# EAGLE design rail (EAGLE 6.1)
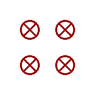
[diagram p0: schematic, sheet 1]

## Parts
JP1  FIDUCIAL1.5X3  [FIDUCIAL-1.5X3]
JP2  FIDUCIAL1.5X3  [FIDUCIAL-1.5X3]
JP3  FIDUCIAL1.5X3  [FIDUCIAL-1.5X3]
JP4  FIDUCIAL1.5X3  [FIDUCIAL-1.5X3]

## Library data of the parts
JP1-JP4 = aspirin:FIDUCIAL: Fiducial Alignment Points Various fiducial points for machine vision alignment.

## Board
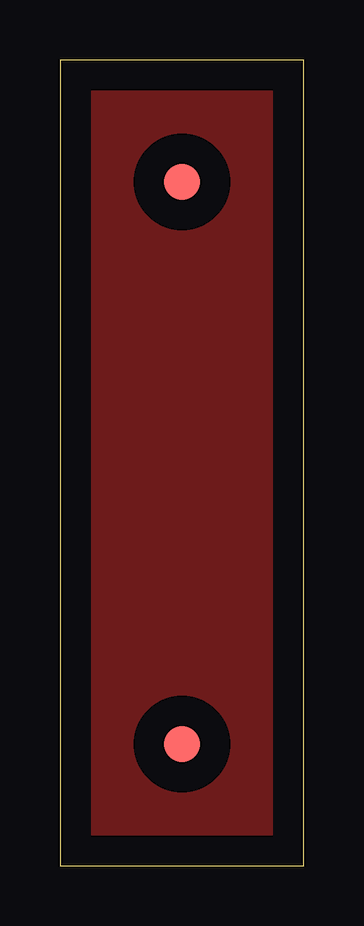
[diagram p1: board, top side]
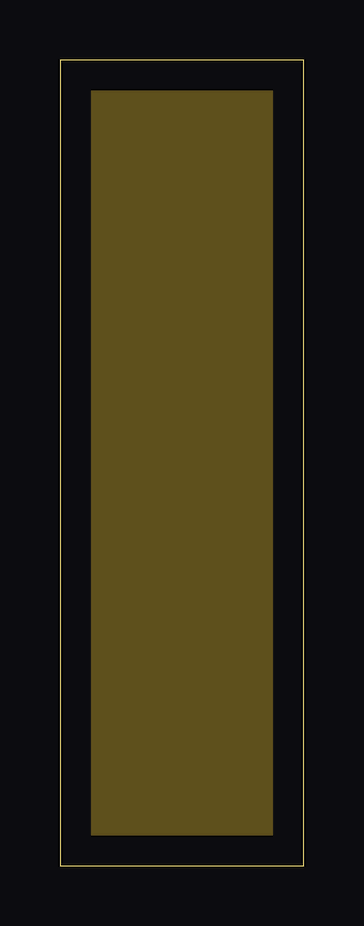
[diagram p2: board, inner layer Route2]
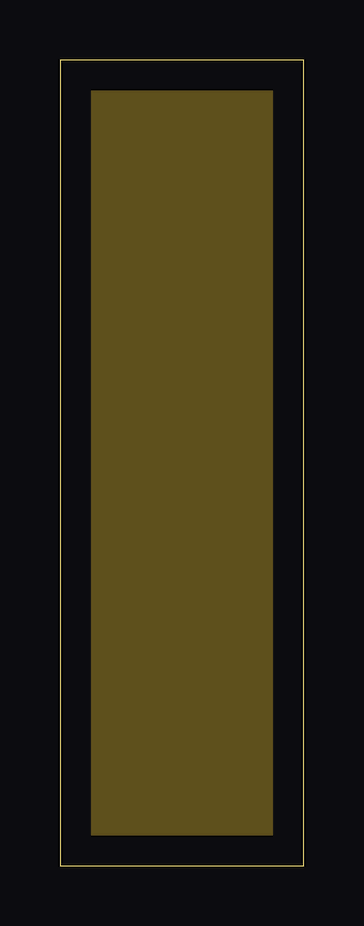
[diagram p3: board, inner layer Route15]
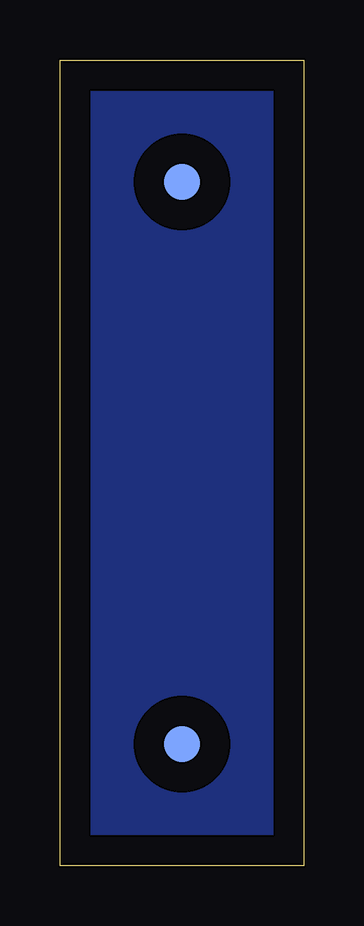
[diagram p4: board, bottom side, seen from below]

Size 10.16 x 33.6 mm. Coordinates in mm from the lower left corner, seen from the top.
Outline: 0,0 10.16,0 10.16,33.6 0,33.6 0,0
Copper layers (1*16): Top 0.035mm / dielectric 1.5mm / Bottom 0.035mm
Design rules: minimum track width 10mil, minimum drill 24mil, track to track 8mil, track to pad 8mil, pad to pad 8mil, via to via 8mil, smd to smd 8mil, copper to edge 40mil, drill to drill 8mil, minimum pad ring 10mil, minimum via ring 8mil, stop-mask expansion 4mil, vias tented up to drill 0mil, thermal gap 10mil

### Footprints (pad centres in the part's own frame; a part is rotated, then mirrored left to right if it is on the bottom)
FIDUCIAL-1.5X3 = smd 1.5 x 1.5: 1 0,0

### Placement (x,y rotation side)
JP1  5.08,5.08 0 top
JP2  5.08,28.52 0 top
JP3  5.08,5.08 0 bottom
JP4  5.08,28.52 0 bottom

### Tracks (layer width: path | path; a pad name or v marks a point on that pad's centre or on a via)
N$1
  pour Bottom (isolate 1.27): 0,0 10.16,0 10.16,33.6 0,33.6
  pour Route15 (isolate 1.27): 0,0 10.16,0 10.16,33.6 0,33.6
  pour Route2 (isolate 1.27): 0,0 10.16,0 10.16,33.6 0,33.6
  pour Top (isolate 1.27): 0,0 10.16,0 10.16,33.6 0,33.6